# Altium project SIWA_PCB.PrjPcb
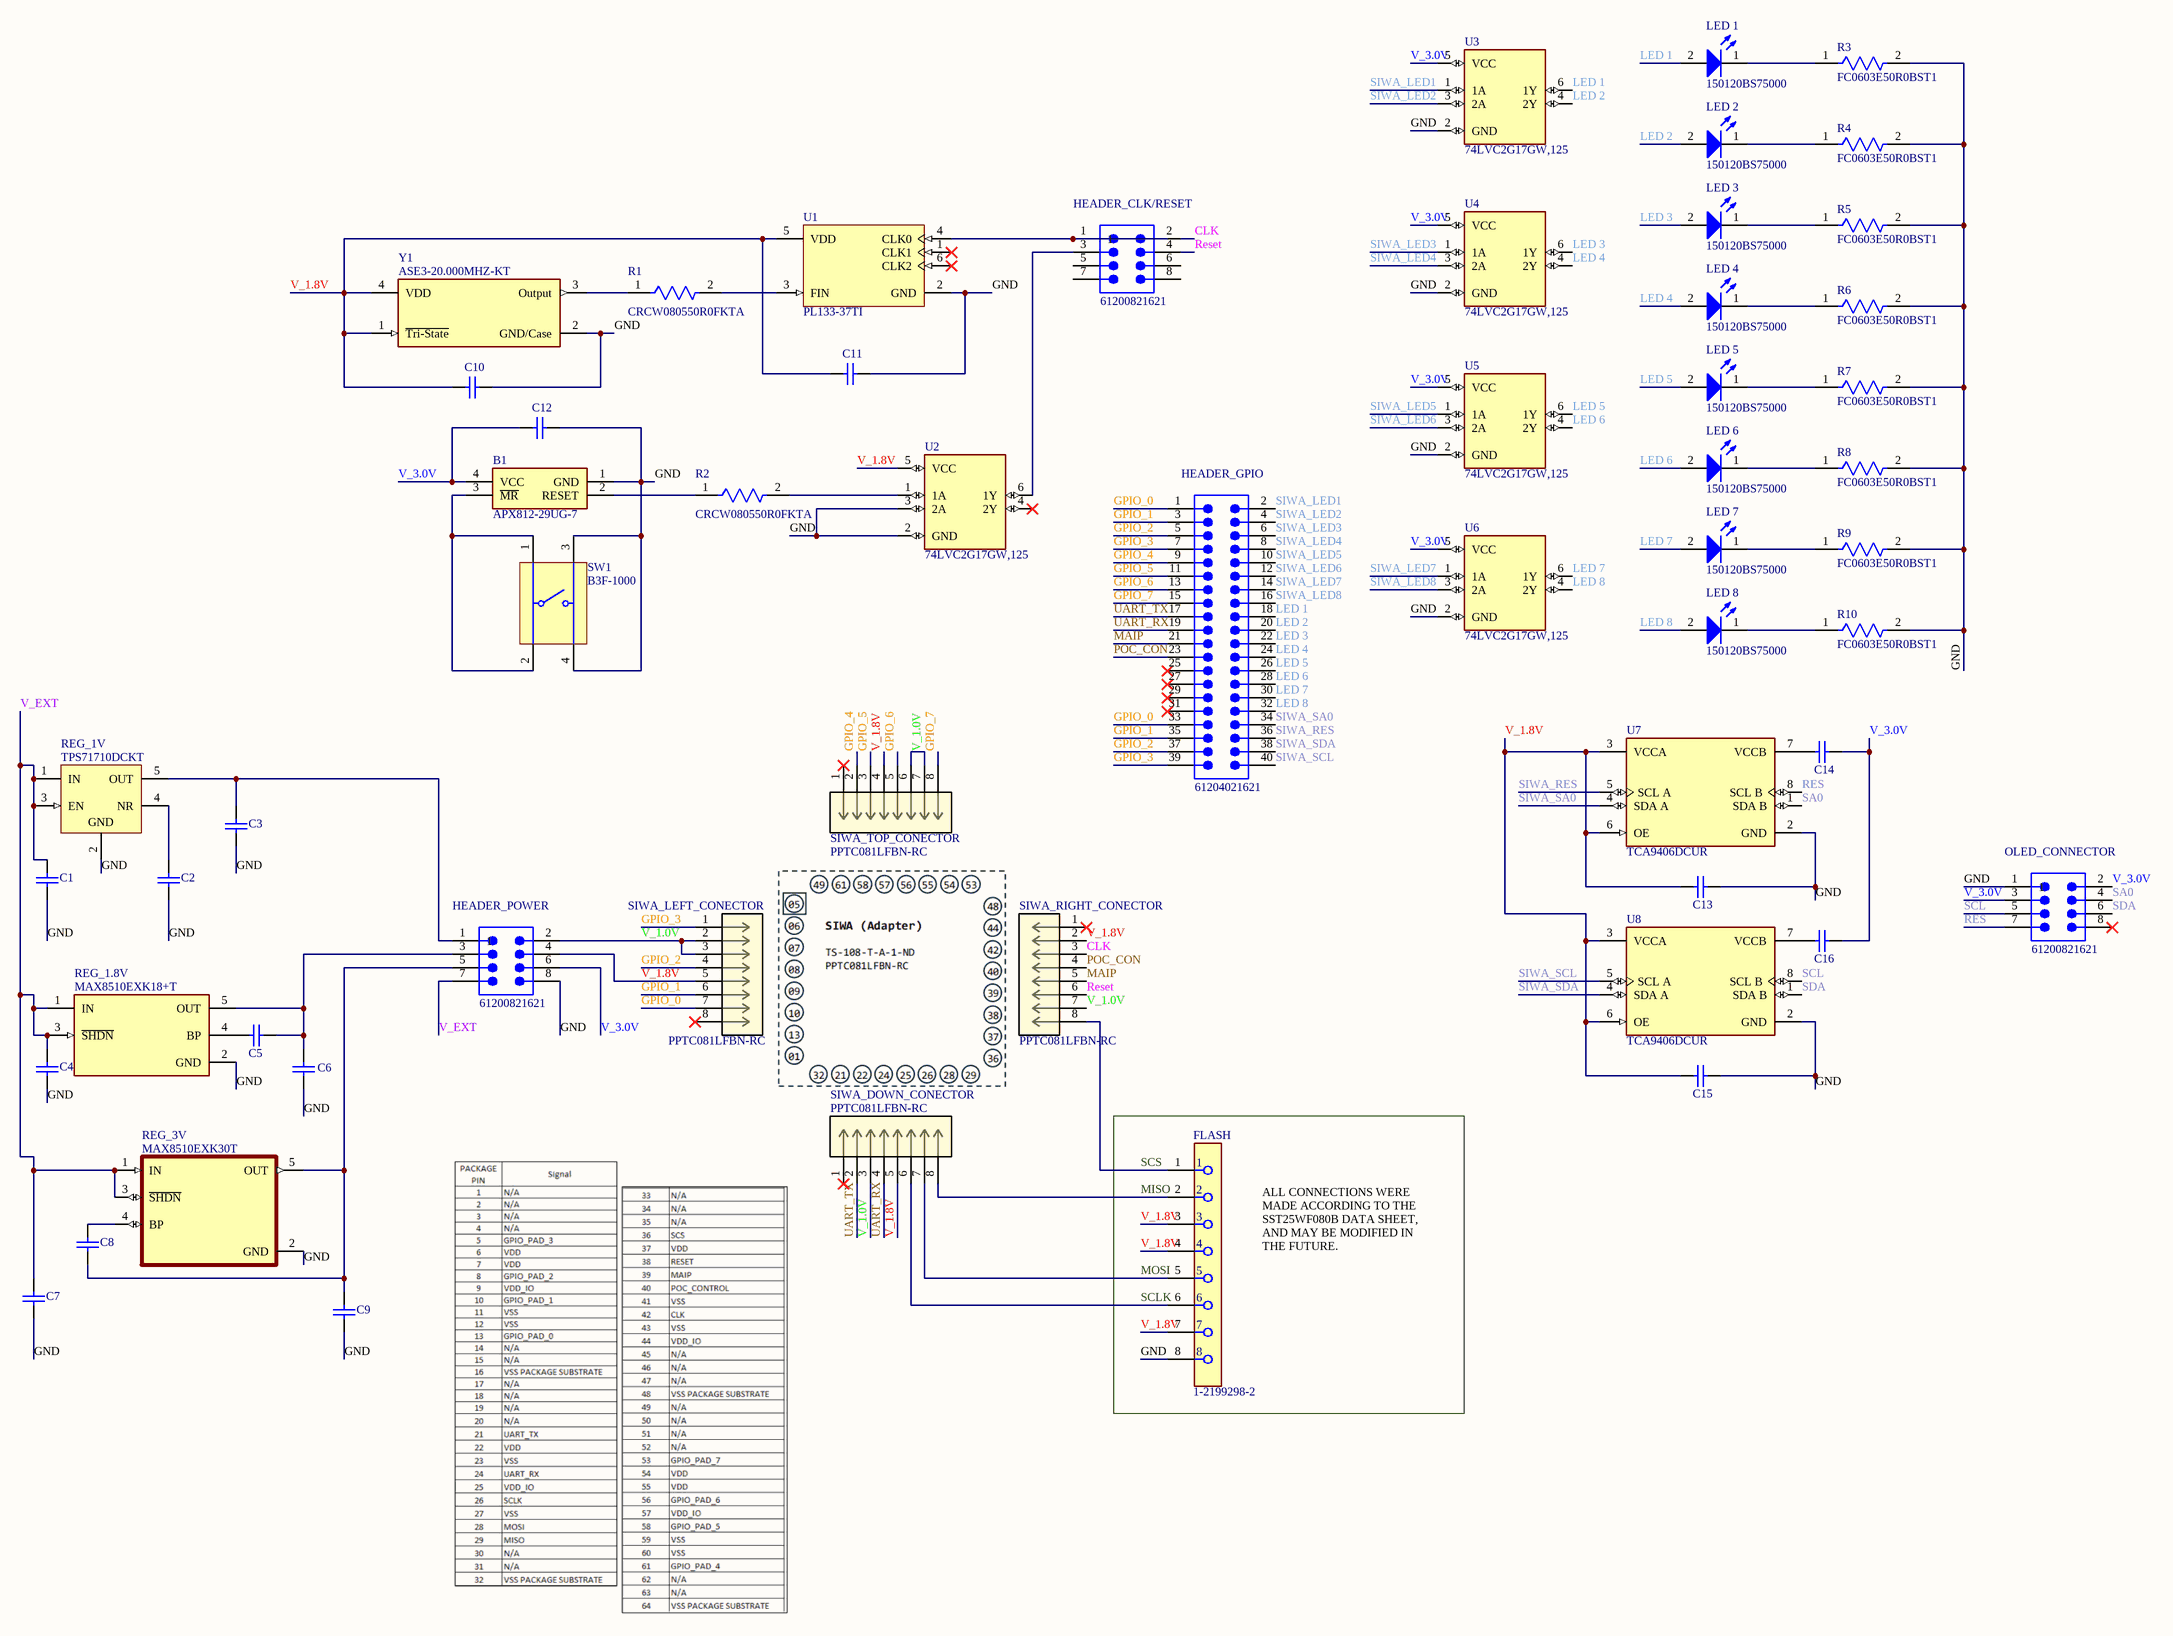
[diagram p0: FULL_PCB.SchDoc]
1 sheet, 57 parts. Net scope: global (net labels, ports and power ports of the same name join across sheets).
Board file: PCB_SIWA.PcbDoc

## Sheet FULL_PCB.SchDoc
size E; SheetNumber: 1; SheetTotal: 1

### Parts
B1  APX812-29UG-7  [APX81229UG7]
C1  VJ0603Y104KXJAP  [CAPC1608X92X38NL15T08]  (value not drawn)
C2  VJ0603Y104KXJAP  [CAPC1608X92X38NL15T08]  (value not drawn)
C3  VJ0603Y104KXJAP  [CAPC1608X92X38NL15T08]  (value not drawn)
C4  VJ0603Y104KXJAP  [CAPC1608X92X38NL15T08]  (value not drawn)
C5  VJ0603Y104KXJAP  [CAPC1608X92X38NL15T08]  (value not drawn)
C6  VJ0603Y104KXJAP  [CAPC1608X92X38NL15T08]  (value not drawn)
C7  VJ0603Y104KXJAP  [CAPC1608X92X38NL15T08]  (value not drawn)
C8  VJ0603Y104KXJAP  [CAPC1608X92X38NL15T08]  (value not drawn)
C9  VJ0603Y104KXJAP  [CAPC1608X92X38NL15T08]  (value not drawn)
C10  VJ0603Y104KXJAP  [CAPC1608X92X38NL15T08]  (value not drawn)
C11  VJ0603Y104KXJAP  [CAPC1608X92X38NL15T08]  (value not drawn)
C12  VJ0603Y104KXJAP  [CAPC1608X92X38NL15T08]  (value not drawn)
C13  VJ0603Y104KXJAP  [CAPC1608X92X38NL15T08]  (value not drawn)
C14  VJ0603Y104KXJAP  [CAPC1608X92X38NL15T08]  (value not drawn)
C15  VJ0603Y104KXJAP  [CAPC1608X92X38NL15T08]  (value not drawn)
C16  VJ0603Y104KXJAP  [CAPC1608X92X38NL15T08]  (value not drawn)
FLASH  1-2199298-2  [FP-1-2199298-2-MFG]
HEADER_CLK/RESET  61200821621  [61200821621]
HEADER_GPIO  61204021621  [61204021621]
HEADER_POWER  61200821621  [61200821621]
LED_1  150120BS75000  [WL-SMCW_1206_150120xx75000]
LED_2  150120BS75000  [WL-SMCW_1206_150120xx75000]
LED_3  150120BS75000  [WL-SMCW_1206_150120xx75000]
LED_4  150120BS75000  [WL-SMCW_1206_150120xx75000]
LED_5  150120BS75000  [WL-SMCW_1206_150120xx75000]
LED_6  150120BS75000  [WL-SMCW_1206_150120xx75000]
LED_7  150120BS75000  [WL-SMCW_1206_150120xx75000]
LED_8  150120BS75000  [WL-SMCW_1206_150120xx75000]
OLED_CONNECTOR  61200821621  [61200821621]
R1  CRCW080550R0FKTA  [FP-D12-CRCW0805-MFG]
R2  CRCW080550R0FKTA  [FP-D12-CRCW0805-MFG]
R3  FC0603E50R0BST1  [FP-FC0603-IPC_B]
R4  FC0603E50R0BST1  [FP-FC0603-IPC_B]
R5  FC0603E50R0BST1  [FP-FC0603-IPC_B]
R6  FC0603E50R0BST1  [FP-FC0603-IPC_B]
R7  FC0603E50R0BST1  [FP-FC0603-IPC_B]
R8  FC0603E50R0BST1  [FP-FC0603-IPC_B]
R9  FC0603E50R0BST1  [FP-FC0603-IPC_B]
R10  FC0603E50R0BST1  [FP-FC0603-IPC_B]
REG_1.8V  MAX8510EXK18+T  [FP-X5-1-MFG]
REG_1V  TPS71710DCKT  [DCK0005A_M]
REG_3V  MAX8510EXK30T  [SOT65P210X110-5N]
SIWA_DOWN_CONECTOR  PPTC081LFBN-RC  [CONN_PPTC081LFBN-RC_SUL]
SIWA_LEFT_CONECTOR  PPTC081LFBN-RC  [CONN_PPTC081LFBN-RC_SUL]
SIWA_RIGHT_CONECTOR  PPTC081LFBN-RC  [CONN_PPTC081LFBN-RC_SUL]
SIWA_TOP_CONECTOR  PPTC081LFBN-RC  [CONN_PPTC081LFBN-RC_SUL]
SW1  B3F-1000  [OMRON-B3F-1000-4_V]
U1  PL133-37TI  [FP-SOT23-6LD-PL-1-MFG]
U2  74LVC2G17GW,125  [SOT363_INFINEON]
U3  74LVC2G17GW,125  [SOT363_INFINEON]
U4  74LVC2G17GW,125  [SOT363_INFINEON]
U5  74LVC2G17GW,125  [SOT363_INFINEON]
U6  74LVC2G17GW,125  [SOT363_INFINEON]
U7  TCA9406DCUR  [FP-DCU0008A-IPC_B]
U8  TCA9406DCUR  [FP-DCU0008A-IPC_B]
Y1  ASE3-20.000MHZ-KT  [FP-ASE3-MFG]

### Nets
CLK: HEADER_CLK/RESET.2 SIWA_RIGHT_CONECTOR.3
GND: B1.1(GND) C1.1 C2.1 C3.1 C4.1 C6.1 C7.1 C9.1 C10.2 C11.2 C12.2 C13.1 C15.1 FLASH.8 HEADER_POWER.8 OLED_CONNECTOR.1 R3.2 R4.2 R5.2 R6.2 R7.2 R8.2 R9.2 R10.2 REG_1.8V.2(GND) REG_1V.2(GND) REG_3V.2(GND) SW1.3 SW1.4 U1.2(GND) U2.2(GND) U2.3(2A) U3.2(GND) U4.2(GND) U5.2(GND) U6.2(GND) U7.2(GND) U8.2(GND) Y1.2(GND/Case)
GPIO_0: HEADER_GPIO.1 HEADER_GPIO.33 SIWA_LEFT_CONECTOR.7
GPIO_1: HEADER_GPIO.3 HEADER_GPIO.35 SIWA_LEFT_CONECTOR.6
GPIO_2: HEADER_GPIO.5 HEADER_GPIO.37 SIWA_LEFT_CONECTOR.4
GPIO_3: HEADER_GPIO.7 HEADER_GPIO.39 SIWA_LEFT_CONECTOR.1
GPIO_4: HEADER_GPIO.9 SIWA_TOP_CONECTOR.2
GPIO_5: HEADER_GPIO.11 SIWA_TOP_CONECTOR.3
GPIO_6: HEADER_GPIO.13 SIWA_TOP_CONECTOR.5
GPIO_7: HEADER_GPIO.15 SIWA_TOP_CONECTOR.8
LED 1: HEADER_GPIO.18 LED_1.2(A) U3.6(1Y)
LED 2: HEADER_GPIO.20 LED_2.2(A) U3.4(2Y)
LED 3: HEADER_GPIO.22 LED_3.2(A) U4.6(1Y)
LED 4: HEADER_GPIO.24 LED_4.2(A) U4.4(2Y)
LED 5: HEADER_GPIO.26 LED_5.2(A) U5.6(1Y)
LED 6: HEADER_GPIO.28 LED_6.2(A) U5.4(2Y)
LED 7: HEADER_GPIO.30 LED_7.2(A) U6.6(1Y)
LED 8: HEADER_GPIO.32 LED_8.2(A) U6.4(2Y)
MAIP: HEADER_GPIO.21 SIWA_RIGHT_CONECTOR.5
MISO: FLASH.2 SIWA_DOWN_CONECTOR.8
MOSI: FLASH.5 SIWA_DOWN_CONECTOR.7
POC_CON: HEADER_GPIO.23 SIWA_RIGHT_CONECTOR.4
RES: OLED_CONNECTOR.7 U7.8(SCL_B)
Reset: HEADER_CLK/RESET.4 SIWA_RIGHT_CONECTOR.6
SA0: OLED_CONNECTOR.4 U7.1(SDA_B)
SCL: OLED_CONNECTOR.5 U8.8(SCL_B)
SCLK: FLASH.6 SIWA_DOWN_CONECTOR.6
SCS: FLASH.1 SIWA_RIGHT_CONECTOR.8
SDA: OLED_CONNECTOR.6 U8.1(SDA_B)
SIWA_LED1: HEADER_GPIO.2 U3.1(1A)
SIWA_LED2: HEADER_GPIO.4 U3.3(2A)
SIWA_LED3: HEADER_GPIO.6 U4.1(1A)
SIWA_LED4: HEADER_GPIO.8 U4.3(2A)
SIWA_LED5: HEADER_GPIO.10 U5.1(1A)
SIWA_LED6: HEADER_GPIO.12 U5.3(2A)
SIWA_LED7: HEADER_GPIO.14 U6.1(1A)
SIWA_LED8: HEADER_GPIO.16 U6.3(2A)
SIWA_RES: HEADER_GPIO.36 U7.5(SCL_A)
SIWA_SA0: HEADER_GPIO.34 U7.4(SDA_A)
SIWA_SCL: HEADER_GPIO.40 U8.5(SCL_A)
SIWA_SDA: HEADER_GPIO.38 U8.4(SDA_A)
UART_RX: HEADER_GPIO.19 SIWA_DOWN_CONECTOR.4
UART_TX: HEADER_GPIO.17 SIWA_DOWN_CONECTOR.2
V_1.0V: HEADER_POWER.2 SIWA_DOWN_CONECTOR.3 SIWA_LEFT_CONECTOR.2 SIWA_LEFT_CONECTOR.3 SIWA_RIGHT_CONECTOR.7 SIWA_TOP_CONECTOR.6 SIWA_TOP_CONECTOR.7
V_1.8V: C10.1 C11.1 C13.2 C15.2 FLASH.3 FLASH.4 FLASH.7 HEADER_POWER.4 SIWA_DOWN_CONECTOR.5 SIWA_LEFT_CONECTOR.5 SIWA_RIGHT_CONECTOR.2 SIWA_TOP_CONECTOR.4 U1.5(VDD) U2.5(VCC) U7.3(VCCA) U7.6(OE) U8.3(VCCA) U8.6(OE) Y1.1(~{Tri-State}) Y1.4(VDD)
V_3.0V: B1.4(VCC) C12.1 C14.1 C16.1 HEADER_POWER.6 OLED_CONNECTOR.2 OLED_CONNECTOR.3 U3.5(VCC) U4.5(VCC) U5.5(VCC) U6.5(VCC)
V_EXT: C1.2 C4.2 C7.2 HEADER_POWER.7 REG_1.8V.1(IN) REG_1.8V.3(~{SHDN}) REG_1V.1(IN) REG_1V.3(EN) REG_3V.1(IN) REG_3V.3(~{SHDN})
NetB1_2: B1.2(RESET) R2.1
NetB1_3: B1.3(~{MR}) SW1.1 SW1.2
NetC2_2: C2.2 REG_1V.4(NR)
NetC3_2: C3.2 HEADER_POWER.1 REG_1V.5(OUT)
NetC5_1: C5.1 C6.2 HEADER_POWER.3 REG_1.8V.5(OUT)
NetC5_2: C5.2 REG_1.8V.4(BP)
NetC8_1: C8.1 C9.2 HEADER_POWER.5 REG_3V.5(OUT)
NetC8_2: C8.2 REG_3V.4(BP)
NetC14_2: C14.2 U7.7(VCCB)
NetC16_2: C16.2 U8.7(VCCB)
NetHEADER_CLK/RESET_1: HEADER_CLK/RESET.1 U1.4(CLK0)
NetHEADER_CLK/RESET_3: HEADER_CLK/RESET.3 U2.6(1Y)
NetLED_1_1: LED_1.1(K) R3.1
NetLED_2_1: LED_2.1(K) R4.1
NetLED_3_1: LED_3.1(K) R5.1
NetLED_4_1: LED_4.1(K) R6.1
NetLED_5_1: LED_5.1(K) R7.1
NetLED_6_1: LED_6.1(K) R8.1
NetLED_7_1: LED_7.1(K) R9.1
NetLED_8_1: LED_8.1(K) R10.1
NetR1_1: R1.1 Y1.3(Output)
NetR1_2: R1.2 U1.3(FIN)
NetR2_2: R2.2 U2.1(1A)

Not connected (* = marked no-connect by the designer): HEADER_CLK/RESET 5 6 7 8; HEADER_GPIO 25* 27* 29* 31*; OLED_CONNECTOR 8*; SIWA_DOWN_CONECTOR 1*; SIWA_LEFT_CONECTOR 8*; SIWA_RIGHT_CONECTOR 1*; SIWA_TOP_CONECTOR 1*; U1 1(CLK1)* 6(CLK2)*; U2 4(2Y)*

### Notes on the sheet
- ALL CONNECTIONS WERE MADE ACCORDING TO THE SST25WF080B DATA SHEET, AND MAY BE MODIFIED IN THE FUTURE.

### Library data of the parts
B1 = APX812-29UG-7: Supervisor Push-Pull, Totem Pole 1 Channel SOT-143 , 2.93V , 140ms , -40C ~ 85C (TA); Manufacturer_Name: Diodes Incorporated; Geometry.Height: 1.1mm; Farnell Part Number: *; Farnell Price/Stock: *; Manufacturer_Part_Number: APX812-29UG-7; Datasheet Link: https://www.diodes.com//assets/Datasheets/APX811_812.pdf
C1-C16 = CMP-2006-01211-1: Manufacturer: Vitramon; Part Number: VJ0603Y104KXJAP
FLASH = CMP-03370-000009-1: CONN IC DIP SOCKET 8POS TIN; Contact Post Length: 3inch; Number of Contacts: 8; Contact Current Rating: 1A; Contact Resistance: 20mR; Insulation Resistance: 1GR; Connector Type: Pin; Row Spacing: 0.3inch; Pitch: 2.54mm; Mating Alignment: Yes (With); RoHS Compliant: Yes; Packaging: Rail/Tube; Contact Material: Bronze; Lead Pitch: 2.54mm; Mount: Through Hole; Termination: Through Hole; Max Operating Temperature: 105°C; Flammability Rating: UL94 V-0; Package Quantity: 60; Contact Finish - Mating: TIN; ELV: Compliant; Radiation Hardening: No; Number of Rows: 2; Series: Diplomate DL; Color: Black; Number of Positions: 8; Contact Plating: Tin; Min Operating Temperature: -40°C; Lead Free: Lead Free; Length: 0.4inch; Orientation: Straight; Housing Material: PBT
HEADER_CLK/RESET HEADER_POWER OLED_CONNECTOR = CMP-1502-00006-3: Wr-bhd; 2.54MM Pitch 8 Way 2 Row Shrouded Straight Pcb Header, Surface Mount; Number of Contacts: 8; Operating Supply Voltage: 250V; Gender: Male; Current Rating: 3A; Contact Resistance: 20mΩ; Connector Type: Male Pin; Insulation Resistance: 1GΩ; Pitch: 2.54mm; RoHS: Compliant; Row Spacing: 2.54mm; Color: Black; Termination: Solder; Min Operating Temperature: -40°C; Number of Rows: 2; Number of Positions: 8; Contact Material: Copper; Orientation: Vertical; Number of Pins: 8; Contact Plating: Gold; Insulation Material: PBT; Lead Pitch: 2.54mm; Length: 17.82mm; Max Operating Temperature: 105°C; Mount: Through Hole
HEADER_GPIO = CMP-1502-00015-4: WR-BHD Straight Male, Box Header, Through Hole, 2 Rows, 40 Contacts, 2.54mm Pitch; Number of Positions: 40; Contact Resistance: 20mΩ; Current Rating: 3A; Connector Type: Male Pin; Operating Supply Voltage: 250V; Insulation Resistance: 1GΩ; Color: Black; Row Spacing: 2.54mm; Pitch: 2.54mm; RoHS: Compliant; Max Operating Temperature: 105°C; Insulation Material: PBT; Number of Pins: 40; Contact Plating: Gold; Orientation: Vertical; Voltage Rating: 250V; Number of Rows: 2; Lead Pitch: 2.54mm; Length: 58.46mm; Mount: Through Hole; Gender: Male; Number of Contacts: 40; Height: 9.25mm; Min Operating Temperature: -40°C; Contact Material: Gold; Termination: Solder; REACH SVHC: Unknown
LED_1-LED_8 = CMP-1426-00015-3: WL-SMCW SMT Mono-Color Chip LED Waterclear; Manufacturer Package Identifier: LED_1206; Dominant Wavelength: 470nm; Lens Style: Clear, Rectangular; Test Current: 20mA; Forward Voltage: 3.2V; Forward Current: 100mA; Peak Wavelength: 465nm; Max Reverse Voltage (DC): 5V; Viewing Angle: 140°; Luminous Intensity: 145mcd; Max Operating Temperature: 85°C; Case Code (Imperial): 1206; Length: 3.2mm; Width: 1.6mm; Min Operating Temperature: -40°C; Height: 680µm; Case Code (Metric): 3216; Packaging: Tape and Reel; RoHS: Compliant; Case/Package: 1206; REACH SVHC: Unknown; Wavelength: 470nm; Mount: Surface Mount; Color: Blue
R1 R2 = CMP-00030-21390498-1: CRCW080550R0FKTA Res Thick Film 0805 50 Ohm 1% 0.125W(1/8W) ±100ppm/C Pad SMD Automotive T/R; Temperature Coefficient: 100ppm/°C; Resistance: 50Ω; Voltage Rating: 150V; Power Rating: 125mW; Length: 2mm; Case Code (Imperial): 0805; Height: 450µm; Contact Plating: Lead, Tin; Width: 1.25mm; Max Operating Temperature: 155°C; NexarPartId: 21390498; Case Code (Metric): 2012; Min Operating Temperature: -55°C; Tolerance: 1%; Case/Package: 0805; Lead Free: Contains Lead; RoHS: Non-Compliant; Composition: Thick Film; Weight: 5.499807mg
R3-R10 = CMP-02407-013076-1: RES SMD 50 OHM 0.1% 1/8W 0603
REG_1.8V = CMP-0246-00401-2: IC REG LINEAR 1.8V 120MA SC70-5; Accuracy: 2%; Number of Outputs: 1; Min Current Limit: 130mA; Max Input Voltage: 6V; Max Power Dissipation: 247mW; Output Configuration: Positive; Output Type: Fixed; Quiescent Current: 90uA; Reference Voltage: 1.225V; Min Input Voltage: 2V; Power Supply Rejection Ratio (PSRR): 54dB; Input Bias Current: 40uA; Output Current: 120mA; Nominal Output Voltage: 1.8V; Output Voltage: 1.8V; Series: -; Number of Regulators: 1; Packaging: Tape and Reel; Mount: Surface Mount; Case/Package: SC; Lead Free: Lead Free; RoHS Compliant: Yes; Number of Pins: 5; Package Quantity: 2500; Max Output Current: 120mA; Polarity: Positive; Min Operating Temperature: -40°C; Max Operating Temperature: 85°C
REG_1V = CMP-0394-00843-2: Single Output High PSRR LDO, 150 mA, Fixed 1 V Output, 2.5 to 6.5 V Input, with Low IQ, 5-pin SC70 (DCK), -40 to 85 degC, Green (RoHS & no Sb/Br); Manufacturer: Texas Instruments; Fixed Output Options(V): 1; Iq(Typ)(mA): 0.05; Vdo(Typ)(mV): 170; Vin(Min)(V): 2.5; Vin(Max)(V): 6.5; Iout(Max)(A): 0.15; Accuracy(%): 3; SubFamily: Single Channel LDO; PackageReference: DCK0005A; Mounting Technology: Surface Mount; Vout Adj(Max)(V): 1; Eco-Plan: Green (RoHS & no Sb/Br); Vout Adj(Min)(V): 1; ComponentLink1URL: http://www.ti.com/; ComponentLink1Description: Manufacturer URL; ComponentLink2URL: http://www.ti.com/general/docs/lit/getliterature.tsp?genericPartNumber=TPS71710&fileType=pdf; ComponentLink3Description: Package Specification; ComponentLink3URL: http://www.ti.com/litv/pdf/mpds025f; Code_JEDEC: MO-203; DatasheetVersion: SBVS068G; ComponentLink2Description: Datasheet; PackageVersion: 4093553-3/G; PackageDescription: 5-Pin Plastic Small-Outline, Body 2 x 1.25 mm, Pitch 0.65 mm; PartNumber: TPS71710DCKT
REG_3V = MAX8510EXK30T: DoÄŸrusal Voltaj RegÃ¼latÃ¶rÃ¼ IC Pozitif Sabit 1 Ã‡Ä±kÄ±ÅŸ 120mA SC-70-5; MF: Maxim Integrated Products; MP: MAX8510EXK30+T; SnapEDA_Link: https://www.snapeda.com/parts/MAX8510EXK30+T/Maxim+Integrated/view-part/?ref=snap; Package: SC-70-5 Maxim; Value: *; Check_prices: https://www.snapeda.com/parts/MAX8510EXK30+T/Maxim+Integrated/view-part/?ref=eda
SIWA_DOWN_CONECTOR SIWA_LEFT_CONECTOR SIWA_RIGHT_CONECTOR SIWA_TOP_CONECTOR = PPTC081LFBN-RC: Description; Manufacturer_Name: Sullins; Copyright: Copyright (C) 2026 Ultra Librarian. All rights reserved.; Manufacturer_Part_Number: PPTC081LFBN-RC; RefDes: RefDes; Type: Type
SW1 = CMP-1677-00002-1: Tactile Switch, SPST-NO, 0.05 A, 5 to 24 V, -25 to 70 degC, 4-Pin THD, RoHS, Bulk; Shielding: Shielded; Gender: Female; Capacitance: -45 f; Voltage Rating: 150 V; Current Rating: 1.5 A; Radiation Hardening: No; Contact Plating: Gold; Height: 14.99 mm; Min Operating Temperature: -40 degC; Packaging: Tray; ComponentLink2Description: Datasheet; ComponentLink1URL: http://www.omron.com/; Lead Pitch: 1.27 mm; RoHSCompliant: true; Pins: 8; PackageReference: B3F-1000; Width: 25.4 mm; Contact Material: Brass; ComponentLink2URL: http://www.omron.com/ecb/products/pdf/en-b3f.pdf; PackageDescription: 4-Pin Through Hole Device, Body 6 x 6 mm; DatasheetVersion: Jan-15; ComponentLink1Description: Manufacturer URL; Package Quantity: 1080; Mount: Through Hole; Length: 18.34 mm; Max Operating Temperature: 70 degC
U1 = CMP-00252-66952958-1: PL133-37TI LVCMOS Sine Wave PL133 SOT-23-6 R-PDSO-G6 clock driver 0.95mm 1.62V~3.63V 150MHz -40C~85C; Number of Circuits: 1; Logic Function: Inverting; Min Supply Voltage: 1.62V; Max Supply Voltage: 3.63V; Number of Outputs: 3; Lifecycle Status: Production; Max Frequency: 150MHz; Schedule B: 8542390000, 8542390000; Mount: Surface Mount; Max Operating Temperature: 85°C; Number of Elements: 1; Lead Free: Lead Free; RoHS: Compliant; Min Operating Temperature: -40°C; Number of Inputs: 1; Input: LVCMOS; Height: 1.45mm
U2-U6 = 74LVC2G17GW,125: Buffer, Non-Inverting 2 Element 1 Bit per Element Push-Pull Output 6-TSSOP; MF: Nexperia USA; SnapEDA_Link: https://www.snapeda.com/parts/74LVC2G17GW,125/Nexperia/view-part/?ref=snap; Package: TSSOP6-6 Nexperia USA Inc.; Value: *; MP: 74LVC2G17GW,125; Check_prices: https://www.snapeda.com/parts/74LVC2G17GW,125/Nexperia/view-part/?ref=eda
U7 U8 = CMP-0314-00417-3: IC TRNSLTR BIDIRECTIONAL US8; Propagation Delay: 4.4ns; Min Supply Voltage: 1.65V; Low Level Output Current: 50mA; Logic Function: Translator; Data Rate: 24Mbps; Turn-On Delay Time: 260ns; Max Supply Voltage: 5.5V; Number of Channels: 2; High Level Output Current: -50mA; Output Type: Voltage; Number of Pins: 8; Weight: 0.00067oz; Lead Free: Lead Free; Case/Package: VSSOP; Packaging: Tape and Reel; REACH SVHC: No SVHC; Package Quantity: 1; Length: 2.1mm; Contact Plating: Gold; Width: 2.4mm; Radiation Hardening: No; Number of Bits: 2; Height: 0.8mm; Number of Outputs: 2; Max Operating Temperature: 85°C; Min Operating Temperature: -40°C
Y1 = CMP-27762-010045-1: XTAL OSC XO 20.0000MHZ CMOS SMD; Min Supply Voltage: 1.71V; Max Supply Current: 4mA; Operating Supply Voltage: 1.8V; Max Supply Voltage: 1.89V; Frequency: 20MHz; Frequency Stability: 30ppm; Load Capacitance: 15pF; Length: 3.2mm; Mount: Surface Mount; Min Operating Temperature: -10°C; Max Operating Temperature: 70°C; Series: ASE3; Height: 0.049inch; Package Quantity: 1000; Depth: 2.5mm; Case/Package: SMD/SMT; Number of Pins: 4; Lead Free: Lead Free; Width: 0.098inch; Termination: SMD/SMT; Packaging: Tape and Reel; Radiation Hardening: No